# EasyEDA schematic SCH_IH-001.json
TITLE: Injectyll-HIDe PCB w/ USB-A and SWD, 2.4 GHz TH; REV: 2.20; Date: 2022-06-08; Sheet: 1/1; Company: Fischer & Miller
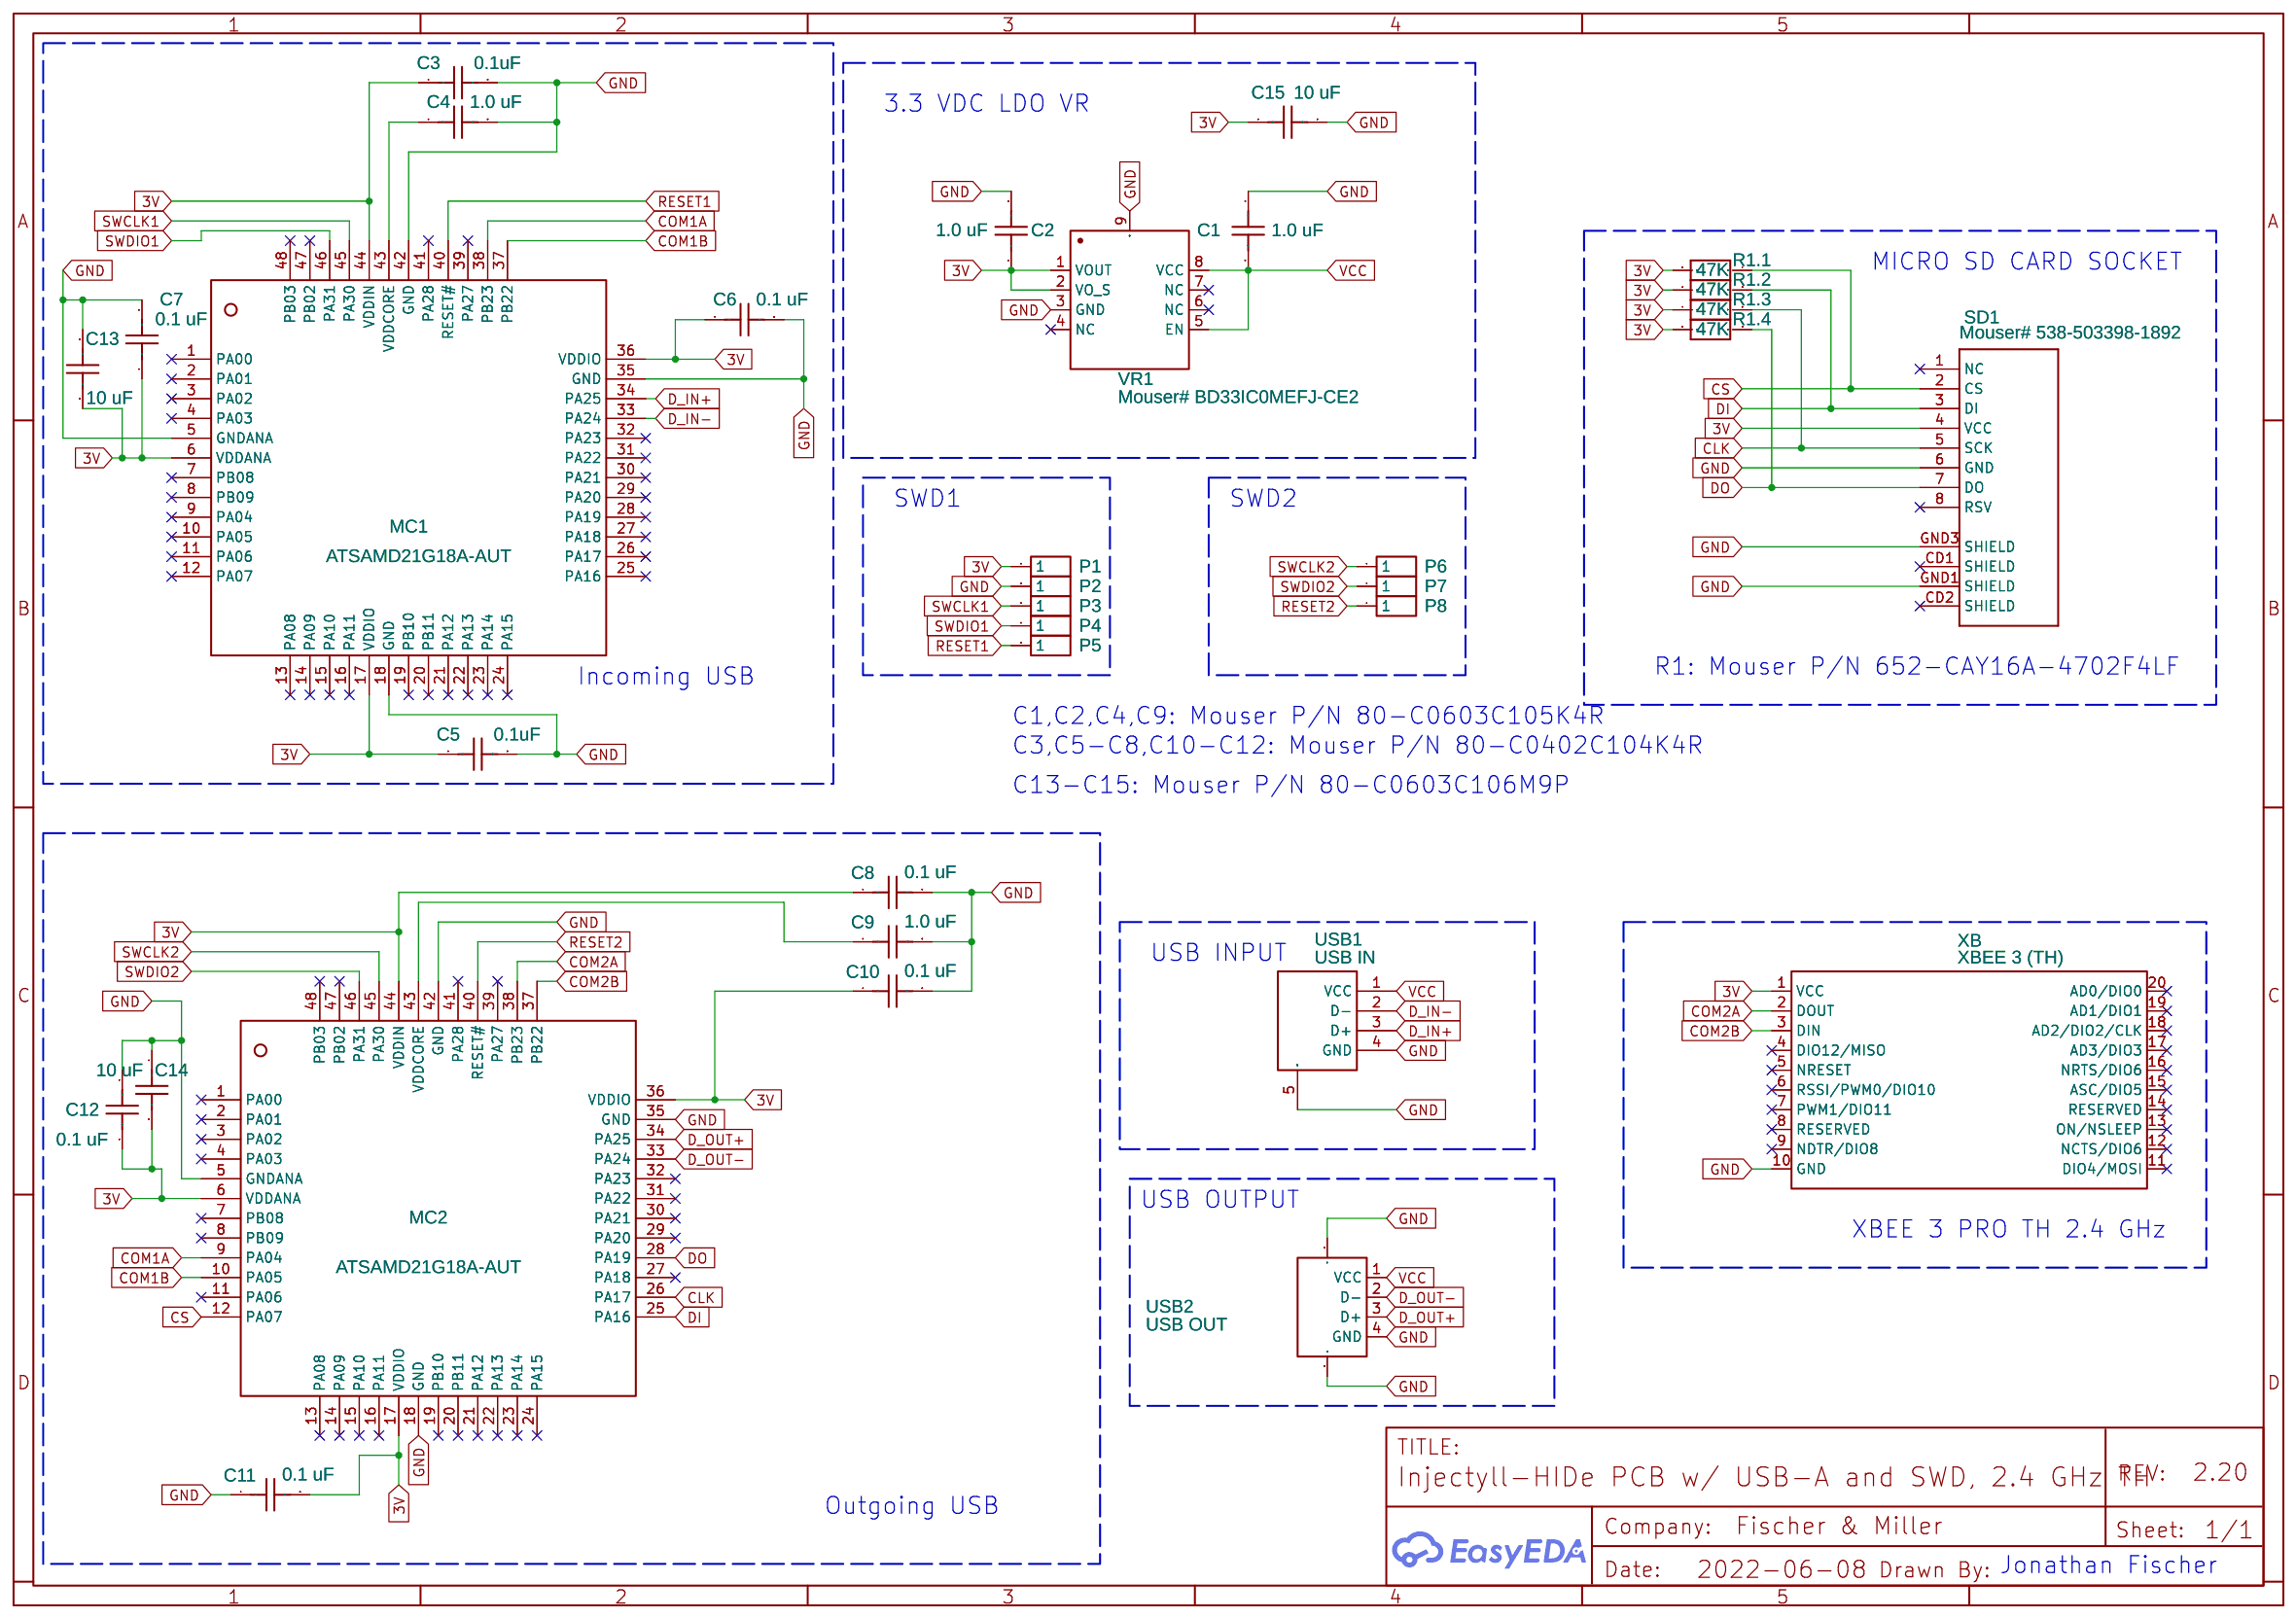
[diagram p0: schematic sheet]

## Parts
C1  1.0 uF  [C0603]
C2  1.0 uF  [C0603]
C3  0.1uF  [C0402_NEW]
C4  1.0 uF  [C0603]
C5  0.1uF  [C0402_NEW]
C6  0.1 uF  [C0402_NEW]
C7  0.1 uF  [C0402_NEW]
C8  0.1 uF  [C0402_NEW]
C9  1.0 uF  [C0603]
C10  0.1 uF  [C0402_NEW]
C11  0.1 uF  [C0402_NEW]
C12  0.1 uF  [C0402_NEW]
C13  10 uF  [C0603]
C14  10 uF  [C0603]
C15  10 uF  [C0603]
MC1  ATSAMD21G18A-AUT  [TQFP-48_L7.0-W7.0-P0.50-LS9.0-BL]
MC2  ATSAMD21G18A-AUT  [TQFP-48_L7.0-W7.0-P0.50-LS9.0-BL]
P1  Header-Male-2.54_1x1  [HDR-TH_1P-P2.54-V-M]
P2  Header-Male-2.54_1x1  [HDR-TH_1P-P2.54-V-M]
P3  Header-Male-2.54_1x1  [HDR-TH_1P-P2.54-V-M]
P4  Header-Male-2.54_1x1  [HDR-TH_1P-P2.54-V-M]
P5  Header-Male-2.54_1x1  [HDR-TH_1P-P2.54-V-M]
P6  Header-Male-2.54_1x1  [HDR-TH_1P-P2.54-V-M]
P7  Header-Male-2.54_1x1  [HDR-TH_1P-P2.54-V-M]
P8  Header-Male-2.54_1x1  [HDR-TH_1P-P2.54-V-M]
R1  47K  [RESPACK_4X0603]  (sections 1,2,3,4)
SD1  Mouser# 538-503398-1892  [MICRO-SD-SOCKET-PP]
USB1  USB IN  [USB-A-TH_UE27AC54100]
USB2  USB OUT  [USB-A-TH_48037-0001]
VR1  Mouser# BD33IC0MEFJ-CE2  [HTSOP-J8_L4.9-W3.9-P1.27-LS6.0-BL-EP]
XB  XBEE 3 (TH)  [XBEE 3 (TH)]

## Library data of the parts
C1-C15 = C_0603_US: Contributor: LCEDA_Lib
MC1 MC2 = ATSAMD21G18A-AUT: Supplier: LCSC; Supplier Part: C619123; Manufacturer: MICROCHIP(美国微芯); Contributor: LCSC; JLCPCB Part Class: Extended Part; Package Display: No
P1-P8 = Header-Male-2.54_1x1: Supplier: LCSC; Manufacturer: ReliaPro; Supplier Part: C81276; JLCPCB Part Class: Extended Part
R1 = RESISTOR_4PACK: Contributor: craig_price; subpart_no: 1
SD1 = USD-SOCKET: Contributor: SparkFun; Supplier: Mouser; Supplier Part: 538-503398-1892; Manufacturer: Molex
USB1 = UE27AC54100: Supplier: LCSC; Supplier Part: C464564; Manufacturer: Amphenol ICC; Contributor: LCSC; JLCPCB Part Class: Extended Part
USB2 = USB-Type A_Male: Supplier Part: C112454; Supplier: LCSC; Manufacturer: SOFNG; Manufacturer Part: USB-05; Contributor: LCEDA_Lib
VR1 = BD33IC0MEFJ-CE2: Supplier: LCSC; Supplier Part: C559356; Manufacturer: ROHM Semicon; Contributor: LCSC; JLCPCB Part Class: Extended Part
XB = XBEE 3 (TH): Manufacturer: Digi; link: https://www.digi.com/products/embedded-systems/digi-xbee/rf-modules/2-4-ghz-rf-modules/xbee3-zigbee-3#productsupport; Contributor: MEBenz

## Nets
3V: C2.1 C3.1 C5.1 C6.1 C7.1 C8.1 C10.1 C11.2 C12.2 C13.1 C14.2 C15.1 MC1.6(VDDANA) MC1.17(VDDIO) MC1.36(VDDIO) MC1.44(VDDIN) MC2.6(VDDANA) MC2.17(VDDIO) MC2.36(VDDIO) MC2.44(VDDIN) P1.1 R1.1 R1.2(1) R1.3(1) R1.4(1) SD1.4(VCC) VR1.1(VOUT) VR1.2(VO_S) XB.1(VCC)
GND: C1.1 C2.2 C3.2 C4.2 C5.2 C6.2 C7.2 C8.2 C9.2 C10.2 C11.1 C12.1 C13.2 C14.1 C15.2 MC1.5(GNDANA) MC1.18(GND) MC1.35(GND) MC1.42(GND) MC2.5(GNDANA) MC2.18(GND) MC2.35(GND) MC2.42(GND) P2.1 SD1.6(GND) SD1.GND1(SHIELD) SD1.GND3(SHIELD) USB1.4(GND) USB1.5(SHLD) USB2.4(GND) USB2.5 USB2.6 VR1.3(GND) VR1.9(PAD) XB.10(GND)
VCC: C1.2 USB1.1(VCC) USB2.1(VCC) VR1.5(EN) VR1.8(VCC)
CLK: MC2.26(PA17) R1.5(2) SD1.5(SCK)
COM1A: MC1.38(PB23) MC2.9(PA04)
COM1B: MC1.37(PB22) MC2.10(PA05)
COM2A: MC2.38(PB23) XB.2(DOUT)
COM2B: MC2.37(PB22) XB.3(DIN)
CS: MC2.12(PA07) R1.7(2) SD1.2(CS)
D_IN+: MC1.34(PA25) USB1.3(D+)
D_IN-: MC1.33(PA24) USB1.2(D-)
D_OUT+: MC2.34(PA25) USB2.3(D+)
D_OUT-: MC2.33(PA24) USB2.2(D-)
DI: MC2.25(PA16) R1.8(2) SD1.3(DI)
DO: MC2.28(PA19) R1.6(2) SD1.7(DO)
RESET1: MC1.40(RESET#) P5.1
RESET2: MC2.40(RESET#) P8.1
SWCLK1: MC1.45(PA30) P3.1
SWCLK2: MC2.45(PA30) P6.1
SWDIO1: MC1.46(PA31) P4.1
SWDIO2: MC2.46(PA31) P7.1
Net-(C4-1): C4.1 MC1.43(VDDCORE)
Net-(C9-1): C9.1 MC2.43(VDDCORE)

Not connected (* = marked no-connect by the designer): MC1 1(PA00)* 2(PA01)* 3(PA02)* 4(PA03)* 7(PB08)* 8(PB09)* 9(PA04)* 10(PA05)* 11(PA06)* 12(PA07)* 13(PA08)* 14(PA09)* 15(PA10)* 16(PA11)* 19(PB10)* 20(PB11)* 21(PA12)* 22(PA13)* 23(PA14)* 24(PA15)* 25(PA16)* 26(PA17)* 27(PA18)* 28(PA19)* 29(PA20)* 30(PA21)* 31(PA22)* 32(PA23)* 39(PA27)* 41(PA28)* 47(PB02)* 48(PB03)*; MC2 1(PA00)* 2(PA01)* 3(PA02)* 4(PA03)* 7(PB08)* 8(PB09)* 11(PA06)* 13(PA08)* 14(PA09)* 15(PA10)* 16(PA11)* 19(PB10)* 20(PB11)* 21(PA12)* 22(PA13)* 23(PA14)* 24(PA15)* 27(PA18)* 29(PA20)* 30(PA21)* 31(PA22)* 32(PA23)* 39(PA27)* 41(PA28)* 47(PB02)* 48(PB03)*; SD1 1(NC)* 8(RSV)* CD1(SHIELD)* CD2(SHIELD)*; VR1 4(NC)* 6(NC)* 7(NC)*; XB 4(DIO12/MISO)* 5(NRESET)* 6(RSSI/PWM0/DIO10)* 7(PWM1/DIO11)* 8(RESERVED)* 9(NDTR/DIO8)* 11(DIO4/MOSI)* 12(NCTS/DIO6)* 13(ON/NSLEEP)* 14(RESERVED)* 15(ASC/DIO5)* 16(NRTS/DIO6)* 17(AD3/DIO3)* 18(AD2/DIO2/CLK)* 19(AD1/DIO1)* 20(AD0/DIO0)*

## Notes on the sheet
- 3.3 VDC LDO VR
- MICRO SD CARD SOCKET
- SWD1
- SWD2
- Incoming USB
- R1: Mouser P/N 652-CAY16A-4702F4LF
- C1,C2,C4,C9: Mouser P/N 80-C0603C105K4R
- C3,C5-C8,C10-C12: Mouser P/N 80-C0402C104K4R
- C13-C15: Mouser P/N 80-C0603C106M9P
- USB INPUT
- USB OUTPUT
- XBEE 3 PRO TH 2.4 GHz
- Outgoing USB
- Jonathan Fischer
